# EAGLE design Arm Board V3 (EAGLE 6.5.0)

## Sheet 1 of 6: Power
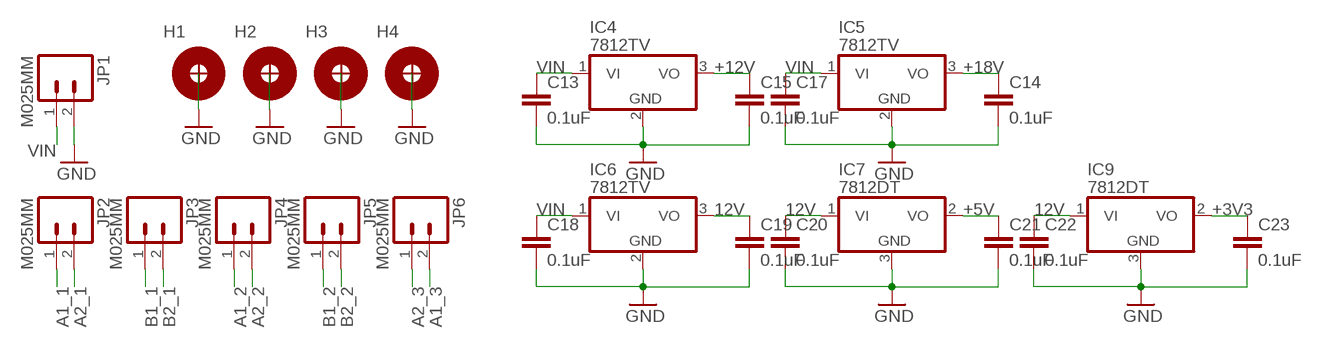
[diagram p0: schematic, sheet 1]

### Parts
C13  0.1uF  0.1UF-25V(+80/-20%)(0603)  [0603-CAP]
C14  0.1uF  0.1UF-25V(+80/-20%)(0603)  [0603-CAP]
C15  0.1uF  0.1UF-25V(+80/-20%)(0603)  [0603-CAP]
C17  0.1uF  0.1UF-25V(+80/-20%)(0603)  [0603-CAP]
C18  0.1uF  0.1UF-25V(+80/-20%)(0603)  [0603-CAP]
C19  0.1uF  0.1UF-25V(+80/-20%)(0603)  [0603-CAP]
C20  0.1uF  0.1UF-25V(+80/-20%)(0603)  [0603-CAP]
C21  0.1uF  0.1UF-25V(+80/-20%)(0603)  [0603-CAP]
C22  0.1uF  0.1UF-25V(+80/-20%)(0603)  [0603-CAP]
C23  0.1uF  0.1UF-25V(+80/-20%)(0603)  [0603-CAP]
H1  H_MNTHOLE_#4  [H_MNTHOLE_#4]
H2  H_MNTHOLE_#4  [H_MNTHOLE_#4]
H3  H_MNTHOLE_#4  [H_MNTHOLE_#4]
H4  H_MNTHOLE_#4  [H_MNTHOLE_#4]
IC4  7812TV  [TO220V]
IC5  7812TV  [TO220V]
IC6  7812TV  [TO220V]
IC7  7812DT  [TO252]
IC9  7812DT  [TO252]
JP1  M025MM  [SCREWTERMINAL-5MM-2]
JP2  M025MM  [SCREWTERMINAL-5MM-2]
JP3  M025MM  [SCREWTERMINAL-5MM-2]
JP4  M025MM  [SCREWTERMINAL-5MM-2]
JP5  M025MM  [SCREWTERMINAL-5MM-2]
JP6  M025MM  [SCREWTERMINAL-5MM-2]

### Nets
12V: C19.1 C20.1 C22.1 IC6.3(VO) IC7.1(VI) IC9.1(VI)
+3V3: C23.1 IC9.2(VO) ; also sheet 3,4,5
+5V: C21.1 IC7.2(VO) ; also sheet 4
+12V: C15.1 IC4.3(VO) ; also sheet 2
+18V: C14.1 IC5.3(VO) ; also sheet 3
A1_1: JP2.1 ; also sheet 2
A1_2: JP4.1 ; also sheet 2
A1_3: JP6.2 ; also sheet 2
A2_1: JP2.2 ; also sheet 2
A2_2: JP4.2 ; also sheet 2
A2_3: JP6.1 ; also sheet 2
B1_1: JP3.1 ; also sheet 2
B1_2: JP5.1 ; also sheet 2
B2_1: JP3.2 ; also sheet 2
B2_2: JP5.2 ; also sheet 2
GND: C13.2 C14.2 C15.2 C17.2 C18.2 C19.2 C20.2 C21.2 C22.2 C23.2 H1.1 H2.1 H3.1 H4.1 IC4.2(GND) IC5.2(GND) IC6.2(GND) IC7.3(GND) IC9.3(GND) JP1.2 ; also sheet 2,3,4,5
VIN: C13.1 C17.1 C18.1 IC4.1(VI) IC5.1(VI) IC6.1(VI) JP1.1 ; also sheet 2

## Sheet 2 of 6: Motor Drivers
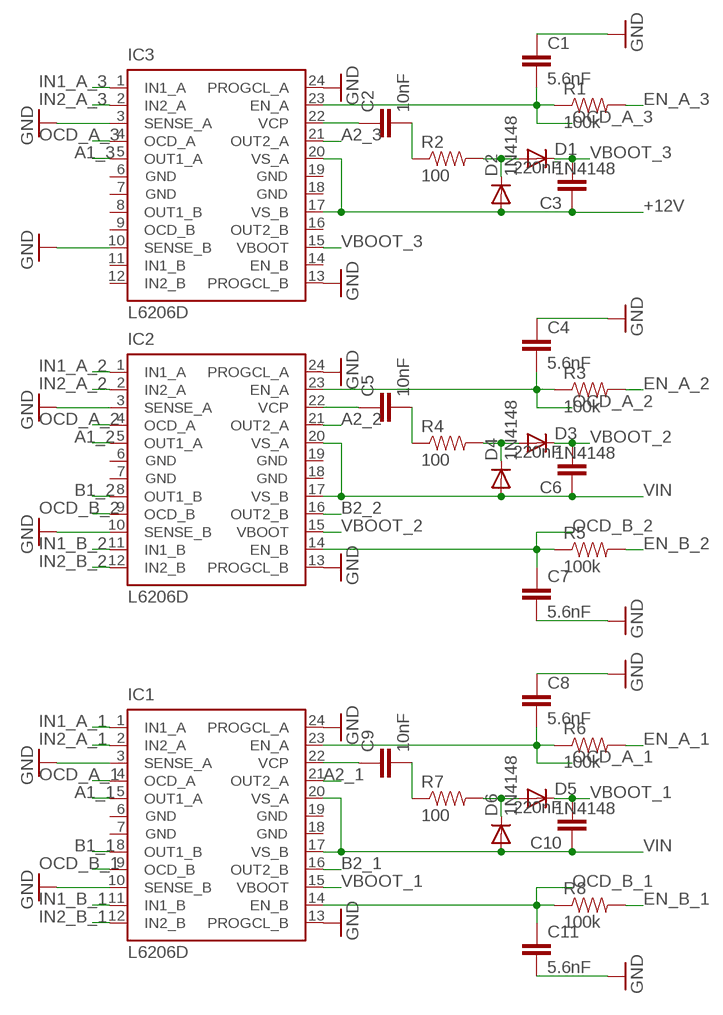
[diagram p1: schematic, sheet 2]

### Parts
C1  5.6nF  0.1UF-25V(+80/-20%)(0603)  [0603-CAP]
C2  10nF  0.1UF-25V-5%(0603)  [0603-CAP]
C3  220nF  0.1UF-25V-5%(0603)  [0603-CAP]
C4  5.6nF  0.1UF-25V(+80/-20%)(0603)  [0603-CAP]
C5  10nF  0.1UF-25V-5%(0603)  [0603-CAP]
C6  220nF  0.1UF-25V-5%(0603)  [0603-CAP]
C7  5.6nF  0.1UF-25V(+80/-20%)(0603)  [0603-CAP]
C8  5.6nF  0.1UF-25V(+80/-20%)(0603)  [0603-CAP]
C9  10nF  0.1UF-25V-5%(0603)  [0603-CAP]
C10  220nF  0.1UF-25V-5%(0603)  [0603-CAP]
C11  5.6nF  0.1UF-25V(+80/-20%)(0603)  [0603-CAP]
D1  1N4148  DIODE1N4148  [DIODE-1N4148]
D2  1N4148  DIODE1N4148  [DIODE-1N4148]
D3  1N4148  DIODE1N4148  [DIODE-1N4148]
D4  1N4148  DIODE1N4148  [DIODE-1N4148]
D5  1N4148  DIODE1N4148  [DIODE-1N4148]
D6  1N4148  DIODE1N4148  [DIODE-1N4148]
IC1  L6206D  [SO24]
IC2  L6206D  [SO24]
IC3  L6206D  [SO24]
R1  100k  RESISTOR0805-RES  [0805]
R2  100  RESISTOR0805-RES  [0805]
R3  100k  RESISTOR0805-RES  [0805]
R4  100  RESISTOR0805-RES  [0805]
R5  100k  RESISTOR0805-RES  [0805]
R6  100k  RESISTOR0805-RES  [0805]
R7  100  RESISTOR0805-RES  [0805]
R8  100k  RESISTOR0805-RES  [0805]

### Nets
+12V: C3.1 D2.A IC3.17(VS_B) IC3.20(VS_A) ; also sheet 1
A1_1: IC1.5(OUT1_A) ; also sheet 1
A1_2: IC2.5(OUT1_A) ; also sheet 1
A1_3: IC3.5(OUT1_A) ; also sheet 1
A2_1: IC1.21(OUT2_A) ; also sheet 1
A2_2: IC2.21(OUT2_A) ; also sheet 1
A2_3: IC3.21(OUT2_A) ; also sheet 1
B1_1: IC1.8(OUT1_B) ; also sheet 1
B1_2: IC2.8(OUT1_B) ; also sheet 1
B2_1: IC1.16(OUT2_B) ; also sheet 1
B2_2: IC2.16(OUT2_B) ; also sheet 1
EN_A_1: R6.2 ; also sheet 4
EN_A_2: R3.2 ; also sheet 4
EN_A_3: R1.2 ; also sheet 4
EN_B_1: R8.2 ; also sheet 4
EN_B_2: R5.2 ; also sheet 4
GND: C1.1 C4.1 C7.2 C8.1 C11.2 IC1.3(SENSE_A) IC1.10(SENSE_B) IC1.13(PROGCL_B) IC1.24(PROGCL_A) IC2.3(SENSE_A) IC2.10(SENSE_B) IC2.13(PROGCL_B) IC2.24(PROGCL_A) IC3.3(SENSE_A) IC3.10(SENSE_B) IC3.13(PROGCL_B) IC3.24(PROGCL_A) ; also sheet 1,3,4,5
IN1_A_1: IC1.1(IN1_A) ; also sheet 4
IN1_A_2: IC2.1(IN1_A) ; also sheet 4
IN1_A_3: IC3.1(IN1_A) ; also sheet 4
IN1_B_1: IC1.11(IN1_B) ; also sheet 4
IN1_B_2: IC2.11(IN1_B) ; also sheet 4
IN2_A_1: IC1.2(IN2_A) ; also sheet 4
IN2_A_2: IC2.2(IN2_A) ; also sheet 4
IN2_A_3: IC3.2(IN2_A) ; also sheet 4
IN2_B_1: IC1.12(IN2_B) ; also sheet 4
IN2_B_2: IC2.12(IN2_B) ; also sheet 4
N$8: D3.A D4.C R4.2
N$9: D5.A D6.C R7.2
N$10: C5.2 R4.1
N$13: C9.1 IC1.22(VCP)
N$15: C9.2 R7.1
N$16: C5.1 IC2.22(VCP)
N$17: D1.A D2.C R2.2
N$18: C2.2 R2.1
N$19: C2.1 IC3.22(VCP)
OCD_A_1: C8.2 IC1.4(OCD_A) IC1.23(EN_A) R6.1
OCD_A_2: C4.2 IC2.4(OCD_A) IC2.23(EN_A) R3.1
OCD_A_3: C1.2 IC3.4(OCD_A) IC3.23(EN_A) R1.1
OCD_B_1: C11.1 IC1.9(OCD_B) IC1.14(EN_B) R8.1
OCD_B_2: C7.1 IC2.9(OCD_B) IC2.14(EN_B) R5.1
VBOOT_1: C10.2 D5.C IC1.15(VBOOT)
VBOOT_2: C6.2 D3.C IC2.15(VBOOT)
VBOOT_3: C3.2 D1.C IC3.15(VBOOT)
VIN: C6.1 C10.1 D4.A D6.A IC1.17(VS_B) IC1.20(VS_A) IC2.17(VS_B) IC2.20(VS_A) ; also sheet 1
Unconnected: IC3.8(OUT1_B) IC3.9(OCD_B) IC3.11(IN1_B) IC3.12(IN2_B) IC3.14(EN_B) IC3.16(OUT2_B)

## Sheet 3 of 6: Dynamixel
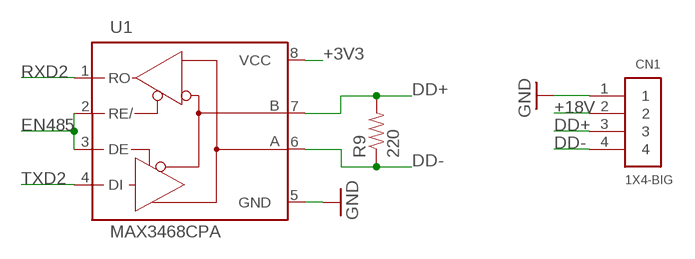
[diagram p2: schematic, sheet 3]

### Parts
CN1  1X4-BIG  [1X04-BIG]
R9  220  RESISTOR0603-RES  [0603-RES]
U1  MAX3468CPA  [DIL08]

### Nets
+3V3: U1.8(VCC) ; also sheet 1,4,5
+18V: CN1.2 ; also sheet 1
DD+ [USB]: CN1.3 R9.2 U1.7(B)
DD-: CN1.4 R9.1 U1.6(A)
EN485: U1.2(RE/) U1.3(DE) ; also sheet 4
GND: CN1.1 U1.5(GND) ; also sheet 1,2,4,5
RXD2: U1.1(RO) ; also sheet 4
TXD2: U1.4(DI) ; also sheet 4

## Sheet 4 of 6: Processor
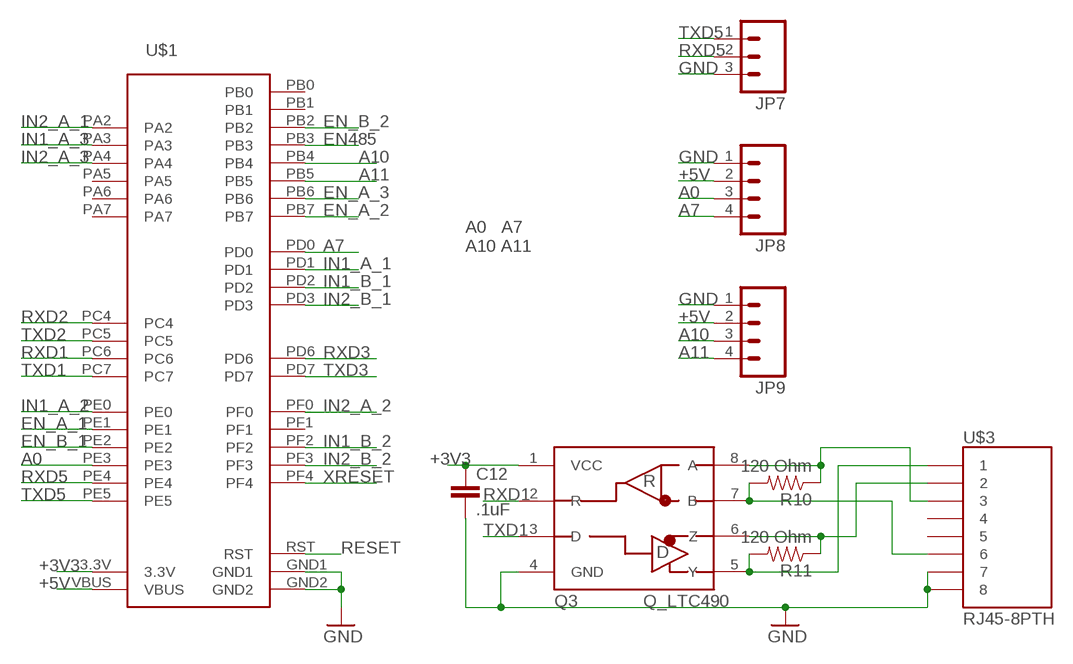
[diagram p3: schematic, sheet 4]

### Parts
C12  .1uF  0.1UF-25V-5%(0603)  [0603-CAP]
JP7  M03PTH  [1X03]
JP8  M04PTH  [1X04]
JP9  M04PTH  [1X04]
Q3  Q_LTC490  [DIP8]
R10  120 Ohm  RESISTOR0603-RES  [0603-RES]
R11  120 Ohm  RESISTOR0603-RES  [0603-RES]
U$1  STELLARIS-LAUNCHPADSTELLARIS-LAUNCHPAD-XL  [LAUNCHPAD-XL]
U$3  RJ45-8PTH  [RJ45-8]

### Nets
+3V3: C12.1 Q3.1(VCC) U$1.3.3V ; also sheet 1,3,5
+5V: JP8.2 JP9.2 U$1.VBUS ; also sheet 1
A0: JP8.3 U$1.PE3
A7: JP8.4 U$1.PD0
A10: JP9.3 U$1.PB4
A11: JP9.4 U$1.PB5
EN485: U$1.PB3 ; also sheet 3
EN_A_1: U$1.PE1 ; also sheet 2
EN_A_2: U$1.PB7 ; also sheet 2
EN_A_3: U$1.PB6 ; also sheet 2
EN_B_1: U$1.PE2 ; also sheet 2
EN_B_2: U$1.PB2 ; also sheet 2
GND: C12.2 JP7.3 JP8.1 JP9.1 Q3.4(GND) U$1.GND1 U$1.GND2 U$3.7 U$3.8 ; also sheet 1,2,3,5
IN1_A_1: U$1.PD1 ; also sheet 2
IN1_A_2: U$1.PE0 ; also sheet 2
IN1_A_3: U$1.PA3 ; also sheet 2
IN1_B_1: U$1.PD2 ; also sheet 2
IN1_B_2: U$1.PF2 ; also sheet 2
IN2_A_1: U$1.PA2 ; also sheet 2
IN2_A_2: U$1.PF0 ; also sheet 2
IN2_A_3: U$1.PA4 ; also sheet 2
IN2_B_1: U$1.PD3 ; also sheet 2
IN2_B_2: U$1.PF3 ; also sheet 2
N$1: Q3.6(Z) R11.1 U$3.2
N$2: Q3.7(B) R10.2 U$3.6
N$3: Q3.8(A) R10.1 U$3.3
N$5: Q3.5(Y) R11.2 U$3.1
RESET: U$1.RST
RXD1: Q3.2(R) U$1.PC6
RXD2: U$1.PC4 ; also sheet 3
RXD3: U$1.PD6 ; also sheet 5
RXD5: JP7.2 U$1.PE4
TXD1: Q3.3(D) U$1.PC7
TXD2: U$1.PC5 ; also sheet 3
TXD3: U$1.PD7 ; also sheet 5
TXD5: JP7.1 U$1.PE5
XRESET: U$1.PF4 ; also sheet 5
Unconnected: U$1.PA5 U$1.PA6 U$1.PA7 U$1.PB0 U$1.PB1 U$1.PF1 U$3.4 U$3.5

### Notes on the sheet
- A0   A7
  A10 A11

## Sheet 5 of 6: Xbee
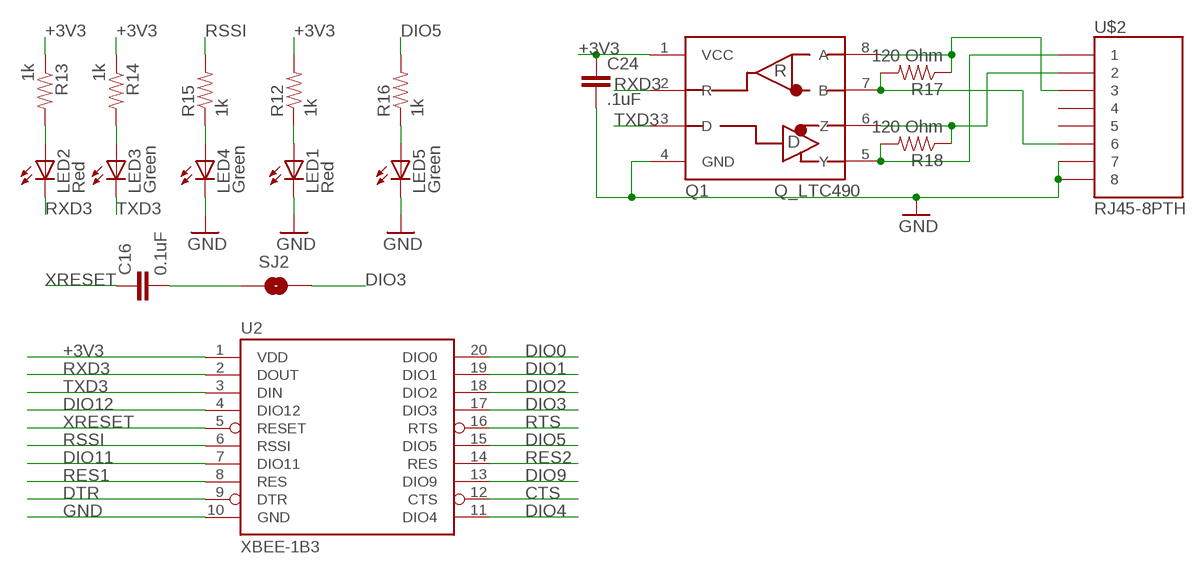
[diagram p4: schematic, sheet 5]

### Parts
C16  0.1uF  0.1UF-25V(+80/-20%)(0603)  [0603-CAP]
C24  .1uF  0.1UF-25V-5%(0603)  [0603-CAP]
LED1  Red  LED-RED0603  [LED-0603]
LED2  Red  LED-RED0603  [LED-0603]
LED3  Green  LED-GREEN0603  [LED-0603]
LED4  Green  LED-GREEN0603  [LED-0603]
LED5  Green  LED-GREEN0603  [LED-0603]
Q1  Q_LTC490  [DIP8]
R12  1k  1KOHM1/10W1%(0603)  [0603-RES]
R13  1k  1KOHM1/10W1%(0603)  [0603-RES]
R14  1k  1KOHM1/10W1%(0603)  [0603-RES]
R15  1k  1KOHM1/10W1%(0603)  [0603-RES]
R16  1k  1KOHM1/10W1%(0603)  [0603-RES]
R17  120 Ohm  RESISTOR0603-RES  [0603-RES]
R18  120 Ohm  RESISTOR0603-RES  [0603-RES]
SJ2  SOLDERJUMPERTRACE  [SJ_2S-TRACE]
U2  XBEE-1B3  [XBEE-SMD]
U$2  RJ45-8PTH  [RJ45-8]

### Nets
+3V3: C24.1 Q1.1(VCC) R12.2 R13.1 R14.1 U2.1(VDD) ; also sheet 1,3,4
CTS: U2.12(CTS)
DIO0: U2.20(DIO0)
DIO1: U2.19(DIO1)
DIO2: U2.18(DIO2)
DIO3: SJ2.2 U2.17(DIO3)
DIO4: U2.11(DIO4)
DIO5: R16.2 U2.15(DIO5)
DIO9: U2.13(DIO9)
DIO11: U2.7(DIO11)
DIO12: U2.4(DIO12)
DTR: U2.9(DTR)
GND: C24.2 LED1.C LED4.C LED5.C Q1.4(GND) U2.10(GND) U$2.7 U$2.8 ; also sheet 1,2,3,4
N$4: LED2.A R13.2
N$6: LED3.A R14.2
N$7: LED4.A R15.1
N$11: C16.2 SJ2.1
N$12: Q1.5(Y) R18.2 U$2.1
N$14: Q1.6(Z) R18.1 U$2.2
N$20: Q1.7(B) R17.2 U$2.6
N$21: Q1.8(A) R17.1 U$2.3
N$38: LED1.A R12.1
N$139: LED5.A R16.1
RES1: U2.8(RES)
RES2: U2.14(RES)
RSSI: R15.2 U2.6(RSSI)
RTS: U2.16(RTS)
RXD3: LED2.C Q1.2(R) U2.2(DOUT) ; also sheet 4
TXD3: LED3.C Q1.3(D) U2.3(DIN) ; also sheet 4
XRESET: C16.1 U2.5(RESET) ; also sheet 4
Unconnected: U$2.4 U$2.5

## Sheet 6 of 6: Encoders

## Power pins joined to a net without a drawn wire
GND: IC1.6(GND) IC1.7(GND) IC1.18(GND) IC1.19(GND) IC2.6(GND) IC2.7(GND) IC2.18(GND) IC2.19(GND) IC3.6(GND) IC3.7(GND) IC3.18(GND) IC3.19(GND)

## Library data of the parts
C1 C4 C7 C8 C11 = SparkFun-Capacitors:0.1UF-25V(+80/-20%)(0603): CAP-00810 Ceramic Standard decoupling cap; PROD_ID: CAP-00810; VALUE: 0.1uF
C2 C3 C5 C6 C9 C10 C12 C24 = SparkFun-Capacitors:0.1UF-25V-5%(0603): CAP-08604; PROD_ID: CAP-08604; VALUE: 0.1uF
C13-C23 = SparkFun-Capacitors:0.1UF-25V(+80/-20%)(0603): CAP-00810 Ceramic Standard decoupling cap; PROD_ID: CAP-00810
CN1 = adafruit:1X4: 4-pin connector
D1-D6 = SparkFun-DiscreteSemi:DIODE: Diode These are standard reverse protection diodes and small signal diodes. SMA package can handle up to about 1A. SOD-323 can handle about 200mA. What the SOD-323 package when ordering, there are some mfgs out there that are 5-pin packages.
H1-H4 = Lib_TH:H_MNTHOLE
IC1-IC3 = L6206D:L6206: DUAL DMOS FULL BRIDGE MOTOR DRIVER
IC4-IC7 IC9 = linear:78*: Positive VOLTAGE REGULATOR Source: http://cache.national.com/ds/LM/LM78L05.pdf http://www.fairchildsemi.com/ds/LM/LM7805.pdf
JP1-JP6 = SparkFun-Connectors:M02: Standard 2-pin 0.1" header. Use with - straight break away headers ( PRT-00116) - right angle break away headers (PRT-00553) - swiss pins (PRT-00743) - machine pins (PRT-00117) - female headers (PRT-00115) Molex polarized connector foot print use with: PRT-08233 with associated crimp pins and housings. 2.54_SCREWTERM for use with PRT-10571. 3.5mm Screw Terminal footprints for PRT-08084 5mm Screw Terminal footprints for use with PRT-08433
JP7 = SparkFun-Connectors:M03: Header 3 Standard 3-pin 0.1" header. Use with straight break away headers (SKU : PRT-00116), right angle break away headers (PRT-00553), swiss pins (PRT-00743), machine pins (PRT-00117), and female headers (PRT-00115). Molex polarized connector foot print use with SKU : PRT-08232 with associated crimp pins and housings.
JP8 JP9 = SparkFun-Connectors:M04: Header 4 Standard 4-pin 0.1" header. Use with straight break away headers (SKU : PRT-00116), right angle break away headers (PRT-00553), swiss pins (PRT-00743), machine pins (PRT-00117), and female headers (PRT-00115). Molex polarized connector foot print use with SKU : PRT-08231 with associated crimp pins and housings. 1MM SMD Version SKU: PRT-10208
LED1 LED2 = SparkFun-LED:LED-RED: Assorted Red LEDs LilyPad 1206- DIO-09912 1206- DIO-00809 0603- DIO-00819; PROD_ID: DIO-00819; VALUE: RED
LED3-LED5 = SparkFun-LED:LED-GREEN: Various green LEDs Green LEDs used in SFE Production 0603- DIO-00821 LARGE- DIO-00862 LILYPAD- DIO-09910; PROD_ID: DIO-00821; VALUE: GREEN
Q1 Q3 = PCB0M1:Q_LTC490: IC, RS422-RS485 DRVR
R1-R11 R17 R18 = SparkFun-Passives:RESISTOR: Resistor Basic schematic elements and footprints for 0603, 1206, and PTH resistors.
R12-R16 = SparkFun-Resistors:1KOHM1/10W1%(0603): RES-07856; PROD_ID: RES-07856; VALUE: 1K
SJ2 = SparkFun:SOLDERJUMPER: Solder Jumper Standard SMD solder jumper. Used to automate production. Two varients : Normally Open and Normally Closed are the same, but have different paste layers. NC will have a large amount of paste and should jumper during reflow.
U1 = maxim:MAX34*: +5V, Fail-Safe, 40Mbps, Profibus RS-485/RS-422 Transceivers Source: MAX3465-MAX3469.pdf; OC_FARNELL: unknown; OC_NEWARK: unknown
U2 = SparkFun:XBEE-1
U$1 = StellarisLaunchPad_Fred:STELLARIS-LAUNCHPAD
U$2 U$3 = SparkFun-Connectors:RJ45-8: RJ45 Jack Simple RJ45, 8-pin connection - connector for common Cat5, Cat5e, and Cat6 Ethernet cables. Footprint not yet proven in production. Connector sku is PRT-00643; Breakout PCB sku is BOB-00716.

## Net classes
1 USB: drill 0.406 mm, clearance 0.203 mm to class 0, clearance 0.406 mm
3 usbvcc: width 0.61 mm, drill 0.508 mm, clearance 0.203 mm to class 0, clearance 0.254 mm

## Board
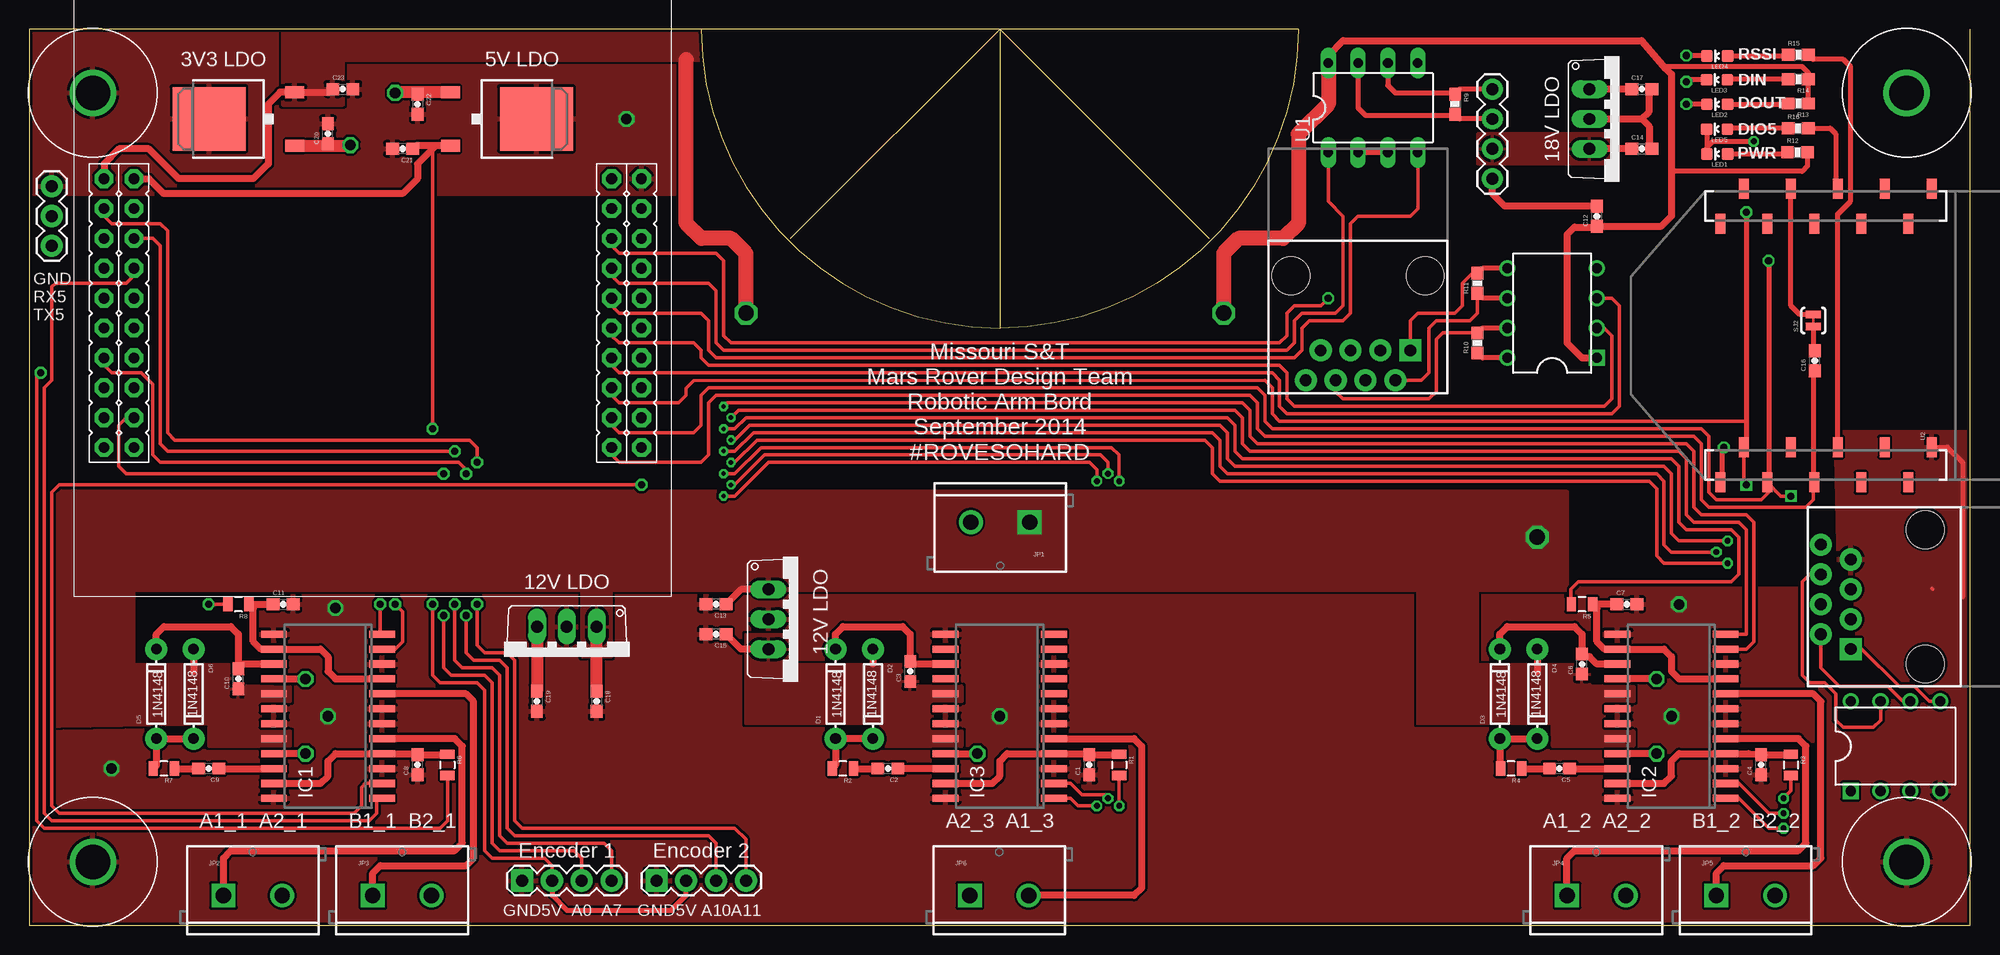
[diagram p5: board, top side]
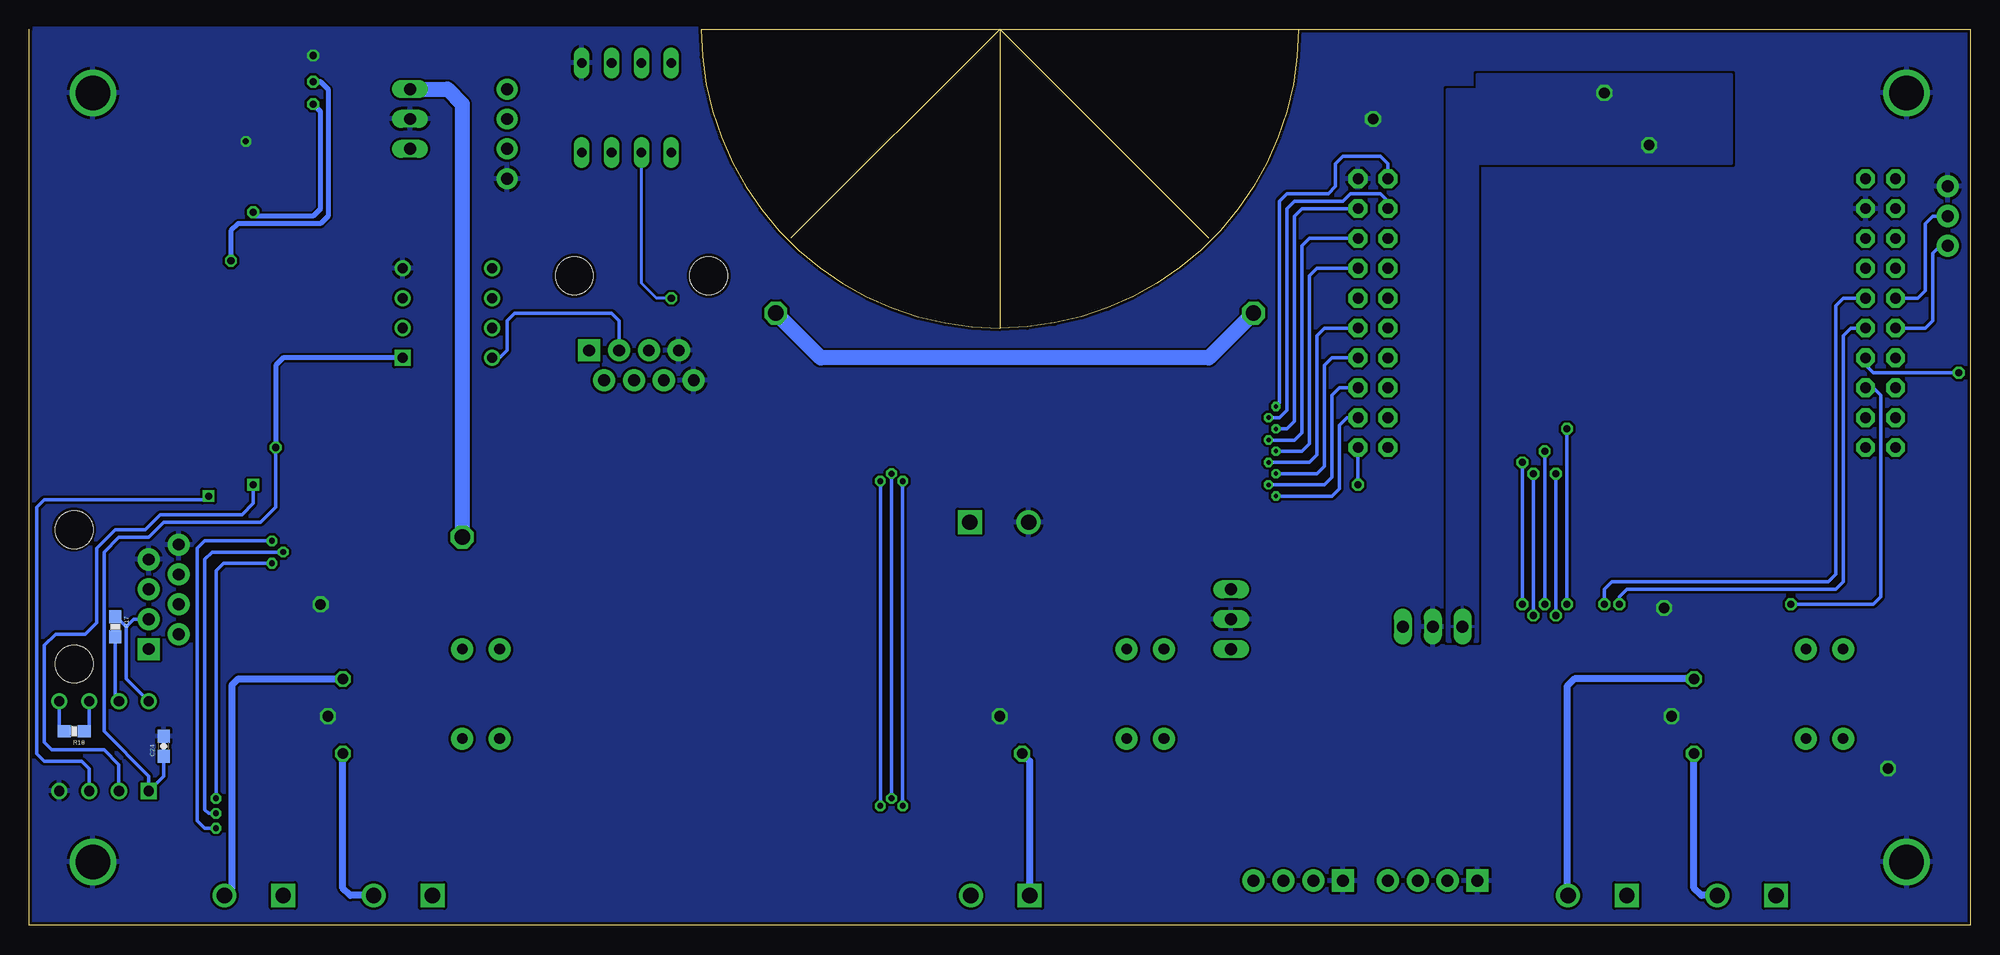
[diagram p6: board, bottom side, seen from below]

Size 165.1 x 76.2 mm. Coordinates in mm from the lower left corner, seen from the top.
Outline: 165.1,76.2 165.1,0 0,0 0,76.2 57.15,76.2
Outline: 82.55,76.2 107.95,76.2 arc-90 82.55,50.8
Outline: 82.55,76.2 57.15,76.2
Outline: 82.55,76.2 82.55,50.8
Outline: 57.15,76.2 arc90 82.55,50.8
Outline: 64.77,58.42 82.55,76.2
Outline: 82.55,76.2 100.33,58.42
Copper layers (1*16): Top 0.035mm / dielectric 1.5mm / Bottom 0.035mm
Design rules "LaenPCBOrder": minimum track width 8mil, minimum drill 10mil, track to track 8mil, track to pad 8mil, pad to pad 8mil, via to via 8mil, smd to smd 8mil, copper to edge 10mil, drill to drill 8mil, minimum pad ring 10mil, minimum via ring 8mil, stop-mask expansion 4mil, vias tented up to drill 0mil, thermal gap 10mil

### Footprints (pad centres in the part's own frame; a part is rotated, then mirrored left to right if it is on the bottom)
0603-CAP = smd 1.1 x 1: 1 -0.85,0; 2 0.85,0
1X04-BIG = drill 1.016 pad 1.778: 1 0,0; 2 2.54,0; 3 5.08,0; 4 7.62,0
DIODE-1N4148 = drill 0.9 pad 1.88: A -3.81,0; C 3.81,0
H_MNTHOLE_#4 = drill 2.946: 1 0,0
SO24 = smd 0.6 x 2.2: 1 -6.985,-4.6; 2 -5.715,-4.6; 3 -4.445,-4.6; 4 -3.175,-4.6; 5 -1.905,-4.6; 6 -0.635,-4.6; 7 0.635,-4.6; 8 1.905,-4.6; 9 3.175,-4.6; 10 4.445,-4.6; 11 5.715,-4.6; 12 6.985,-4.6; 13 6.985,4.6; 14 5.715,4.6; 15 4.445,4.6; 16 3.175,4.6; 17 1.905,4.6; 18 0.635,4.6; 19 -0.635,4.6; 20 -1.905,4.6; 21 -3.175,4.6; 22 -4.445,4.6; 23 -5.715,4.6; 24 -6.985,4.6
TO220V = drill 1.016 long: 1 -2.54,-2.54; 2 0,-2.54; 3 2.54,-2.54
TO252 = smd 1 x 1.6: 1 -2.28,-4.8; 2 2.28,-4.8 | smd 5.4 x 6.2: 3 0,2.5
SCREWTERMINAL-5MM-2 = drill 1.3 pad 2.032 square: 1 0,0 | drill 1.3 pad 2.032: 2 5,0
1X03 = drill 1.016 pad 1.88: 1 0,0; 2 2.54,0; 3 5.08,0
1X04 = drill 1.016 pad 1.88 square: 1 0,0 | drill 1.016 pad 1.88: 2 2.54,0; 3 5.08,0; 4 7.62,0
LED-0603 = smd 1 x 1: A 0,-0.877; C 0,0.877
DIP8 = drill 0.864 square: 1 -3.81,-3.81 | drill 0.864: 2 -1.27,-3.81; 3 1.27,-3.81; 4 3.81,-3.81; 5 3.81,3.81; 6 1.27,3.81; 7 -1.27,3.81; 8 -3.81,3.81
0805 = smd 0.8 x 1.2: 1 -0.9,0; 2 0.9,0
0603-RES = smd 1.1 x 1: 1 -0.85,0; 2 0.85,0
SJ_2S-TRACE = smd 0.635 x 1.27: 1 -0.508,0; 2 0.508,0
DIL08 = drill 0.813 long: 1 -3.81,-3.81; 2 -1.27,-3.81; 3 1.27,-3.81; 4 3.81,-3.81; 5 3.81,3.81; 6 1.27,3.81; 7 -1.27,3.81; 8 -3.81,3.81
XBEE-SMD = smd 1.7 x 0.85: 1 -12.5,20; 2 -9.5,18; 3 -12.5,16; 4 -9.5,14; 5 -12.5,12; 6 -9.5,10; 7 -12.5,8; 8 -9.5,6; 9 -12.5,4; 10 -9.5,2; 11 12.5,2; 12 9.5,4; 13 12.5,6; 14 9.5,8; 15 12.5,10; 16 9.5,12; 17 12.5,14; 18 9.5,16; 19 12.5,18; 20 9.5,20
LAUNCHPAD-XL = drill 0.914 pad 1.6 octagon: 3.3V 30.48,2.54; GND1 33.02,5.08; GND2 30.48,48.26; PA2 53.34,48.26; PA3 50.8,48.26; PA4 48.26,48.26; PA5 48.26,2.54; PA6 50.8,2.54; PA7 53.34,2.54; PB0 35.56,2.54; PB1 38.1,2.54; PB2 33.02,48.26; PB3 35.56,45.72; PB4 45.72,2.54; PB5 33.02,2.54; PB6 45.72,48.26; PB7 43.18,48.26; PC4 38.1,45.72; PC5 40.64,45.72; PC6 43.18,45.72; PC7 45.72,45.72; PD0 35.56,5.08; PD1 38.1,5.08; PD2 40.64,5.08; PD3 43.18,5.08; PD6 48.26,45.72; PD7 50.8,45.72; PE0 35.56,48.26; PE1 45.72,5.08; PE2 48.26,5.08; PE3 50.8,5.08; PE4 40.64,2.54; PE5 43.18,2.54; PF0 38.1,48.26; PF1 53.34,5.08; PF2 30.48,45.72; PF3 33.02,45.72; PF4 53.34,45.72; RST 40.64,48.26; VBUS 30.48,5.08
RJ45-8 = drill 1 pad 1.88 square: 1 -4.445,6.35 | drill 1 pad 1.88: 2 -3.175,8.89; 3 -1.905,6.35; 4 -0.635,8.89; 5 0.635,6.35; 6 1.905,8.89; 7 3.175,6.35; 8 4.445,8.89 | hole 3.2: -5.715,0; 5.715,0

### Placement (x,y rotation side)
C1  90.17,13.65 90 top
C2  73.03,13.34 180 top
C3  74.93,21.59 90 top
C4  147.32,13.65 90 top
C5  130.18,13.34 180 top
C6  132.08,22.23 90 top
C7  135.89,27.3 0 top
C8  33.02,13.65 90 top
C9  15.24,13.34 180 top
C10  17.78,20.95 90 top
C11  21.59,27.3 0 top
C12  133.35,60.33 90 top
C13  58.42,27.3 180 top
C14  137.16,66.04 0 top
C15  58.42,24.77 180 top
C16  151.89,48.01 90 top
C17  137.16,71.12 0 top
C18  48.26,19.05 270 top
C19  43.18,19.05 270 top
C20  25.4,67.31 90 top
C21  31.75,66.04 180 top
C22  33.02,69.85 270 top
C23  26.67,71.12 0 top
C24  153.67,15.24 90 bottom
CN1  124.46,63.5 90 top
D1  68.58,19.68 90 top
D2  71.75,19.68 270 top
D3  125.09,19.68 90 top
D4  128.27,19.68 270 top
D5  10.79,19.68 90 top
D6  13.97,19.68 270 top
H1  5.4,5.4 0 top
H2  5.4,70.8 0 top
H3  159.7,70.8 0 top
H4  159.7,5.4 0 top
IC1  25.4,17.78 90 top
IC2  139.7,17.78 90 top
IC3  82.55,17.78 90 top
IC4  65.41,26.04 270 top
IC5  135.25,68.58 270 top
IC6  45.72,22.86 180 top
IC7  40.64,68.58 270 top
IC9  17.78,68.58 90 top
JP1  85.09,34.29 180 top
JP2  16.51,2.54 0 top
JP3  29.21,2.54 0 top
JP4  130.81,2.54 0 top
JP5  143.51,2.54 0 top
JP6  80.01,2.54 0 top
JP7  1.91,57.78 90 top
JP8  41.91,3.81 0 top
JP9  53.34,3.81 0 top
LED1  143.59,65.61 90 top
LED2  143.59,69.82 90 top
LED3  143.56,71.91 90 top
LED4  143.59,73.94 90 top
LED5  143.56,67.72 90 top
Q1  158.75,15.24 0 top
Q3  129.54,52.07 90 top
R1  92.71,13.65 270 top
R2  69.22,13.34 180 top
R3  149.86,13.65 270 top
R4  126.05,13.34 180 top
R5  132.08,27.3 180 top
R6  35.56,13.65 270 top
R7  11.43,13.34 180 top
R8  17.78,27.3 180 top
R9  121.28,69.85 270 top
R10  123.19,49.53 90 top
R11  123.19,54.61 90 top
R12  150.42,65.76 0 top
R13  150.5,69.9 180 top
R14  150.5,71.96 180 top
R15  150.5,74.04 0 top
R16  150.47,67.79 0 top
R17  157.8,25.4 270 bottom
R18  161.29,16.51 180 bottom
SJ2  151.76,51.44 90 top
U1  114.3,69.53 0 top
U2  163.83,50.16 90 top
U$1  3.81,93.98 270 top
U$2  161.29,27.94 90 top
U$3  113.03,55.24 180 top

### Tracks (layer width: path | path; a pad name or v marks a point on that pad's centre or on a via)
12V  (via drill 0.9)
  Top 0.61: C20.1 25.4,66.3 | C22.1 33.02,70.86
  Top 1.016: IC6.3 C19.1 | IC9.1 25.4,66.3 27.25,66.3 v27.3,66.36 | IC7.1 33.02,70.86 31.17,70.86 v31.11,70.8
  pour Bottom: 41.91,24.13 44.45,24.13 44.45,71.12 41.91,71.12
  pour Bottom: 41.91,72.39 20.32,72.39 20.32,64.77 41.91,64.77
+3V3  (via drill 0.6, 1.3)
  Top 0.406: R13.1 R14.1 151.34,72.49 150.81,73.03 139.38,73.03 139.22,72.87 | U2.1 144.03,37.47 144.03,40.52 v144.15,40.64 | R12.2 151.27,64.59 150.81,64.14 139.7,64.14
  Top 0.61: U$1.3.3V 6.35,64.77 7.62,66.04 10.16,66.04 12.7,63.5 19.05,63.5 20.32,64.77 20.32,69.85 21.33,70.86 IC9.2 25.56,70.86 C23.1 | Q3.1 132.08,48.26 130.81,49.53 130.81,58.74 131.44,59.37 133.25,59.37 C12.1 138.85,59.48 139.7,60.33 139.7,64.14 139.7,72.39 139.22,72.87 137.16,75.25 111.76,75.25 110.49,73.98 U1.8
  Top 1.27: U1.8 110.49,69.85 107.95,67.31 107.95,59.69 106.68,58.42 102.87,58.42 101.6,57.15 v101.6,52.07 | v60.96,52.07 60.96,57.15 59.69,58.42 57.15,58.42 55.88,59.69 55.88,73.66
  Bottom 0.305: v144.15,40.64 144.15,35.56 145.41,34.29 153.67,34.29 154.94,33.02 157.48,33.02 158.75,31.75 158.75,16.51 154.94,12.7 Q1.1 153.67,12.7 C24.1
  Bottom 0.406: Q3.1 143.51,48.26 144.15,47.62 v144.15,40.64
  Bottom 1.27: v60.96,52.07 64.77,48.26 97.79,48.26 v101.6,52.07
  pour Top: 21.59,76.2 21.59,69.85 26.67,69.85 26.67,73.66 57.15,73.66 57.15,76.2
+5V  (via drill 0.6)
  Top 0.305: JP8.2 44.45,5.08 43.81,5.71 39.37,5.71 38.73,6.35 38.73,20 38.1,20.64 34.92,20.64 34.29,21.27 v34.29,27.3 | 36.2,65.94 IC7.2 | v34.29,42.23 34.29,66.04
  Top 0.406: JP8.2 44.45,2.54 45.72,1.27 54.61,1.27 55.88,2.54 JP9.2
  Top 0.61: U$1.VBUS 10.16,63.5 11.43,62.23 31.75,62.23 33.02,63.5 33.02,64.77 34.29,66.04 34.55,66.3 | IC7.2 34.55,66.3 | 34.55,66.3 32.86,66.3 C21.1
  Bottom 0.305: v34.29,27.3 v34.29,42.23
+12V
  Top 0.61: D2.A 71.75,22.23 | IC4.3 60.54,23.5 C15.1
  pour Top: 75.56,22.23 75.56,17.14 60.96,17.14 60.96,24.77 64.77,24.77 64.77,22.23
  pour Top (no thermals): 72.39,17.14 72.39,15.24 79.38,15.24 79.38,16.51 76.83,16.51 76.83,19.05 79.38,19.05 79.38,20.32 75.56,20.32 75.56,17.14
+18V
  Top 0.61: C14.1 IC5.3
  pour Top: 123.19,67.31 123.19,64.77 134.62,64.77 134.62,67.31
A0  (via drill 0.6)
  Top 0.305: JP8.3 46.99,5.71 46.35,6.35 40.01,6.35 39.37,6.99 39.37,20.64 38.73,21.27 35.88,21.27 35.24,21.91 v35.24,26.35 | v35.24,38.42 8.26,38.42 7.62,39.05 7.62,42.55 8.26,43.18 U$1.PE3
  Bottom 0.305: v35.24,26.35 v35.24,38.42
A1_1
  Top 0.61: JP2.1 16.51,5.71 17.14,6.35 36.2,6.35 36.83,6.99 36.83,15.24 36.2,15.88 IC1.5
A1_2
  Top 0.61: JP4.1 130.81,5.71 131.44,6.35 150.5,6.35 151.13,6.99 151.13,15.24 150.5,15.88 IC2.5
A1_3
  Top 0.61: IC3.5 93.98,15.88 94.61,15.24 94.61,3.17 93.98,2.54 JP6.2
A2_1  (via drill 0.9)
  Top 0.61: v23.5,14.61 IC1.21
  Bottom 0.61: JP2.2 22.86,2.54 23.5,3.17 v23.5,14.61
A2_2  (via drill 0.9)
  Top 0.61: v138.43,14.61 IC2.21
  Bottom 0.61: JP4.2 137.79,2.54 138.43,3.17 v138.43,14.61
A2_3  (via drill 0.9)
  Top 0.61: IC3.21 v80.64,14.61
  Bottom 0.61: v80.64,14.61 80.01,13.97 JP6.1
A7  (via drill 0.6)
  Top 0.305: JP8.4 49.53,6.35 48.9,6.99 40.64,6.99 40.01,7.62 40.01,21.27 39.37,21.91 36.83,21.91 36.2,22.54 v36.2,27.3 | v36.2,40.32 11.75,40.32 11.11,40.96 11.11,57.78 10.48,58.42 U$1.PD0
  Bottom 0.305: v36.2,27.3 v36.2,40.32
A10  (via drill 0.6)
  Top 0.305: JP9.3 58.42,6.99 57.78,7.62 41.27,7.62 40.64,8.26 40.64,21.91 40.01,22.54 37.78,22.54 37.15,23.18 v37.15,26.35 | v37.15,38.42 37.15,38.73 36.51,39.37 11.11,39.37 10.48,40.01 10.48,46.04 9.53,46.99 6.99,46.99 6.35,47.62 U$1.PB4
  Bottom 0.305: v37.15,26.35 v37.15,38.42
A11  (via drill 0.6)
  Top 0.305: v38.1,27.3 38.1,23.81 38.73,23.18 40.64,23.18 41.27,22.54 41.27,8.89 41.91,8.26 60.01,8.26 60.96,7.3 JP9.4 | v38.1,39.37 38.1,40.64 37.47,41.27 12.38,41.27 11.75,41.91 11.75,59.05 11.11,59.69 6.99,59.69 6.35,60.33 U$1.PB5
  Bottom 0.305: v38.1,27.3 v38.1,39.37
B1_1
  Top 0.61: JP3.1 29.21,4.45 29.84,5.08 37.15,5.08 37.78,5.71 37.78,19.05 37.15,19.68 IC1.8
B1_2
  Top 0.61: JP5.1 143.51,4.45 144.15,5.08 151.76,5.08 152.4,5.71 152.4,19.05 151.76,19.68 IC2.8
B2_1  (via drill 0.9)
  Top 0.61: IC1.16 v23.5,20.95
  Bottom 0.61: v23.5,20.95 33.66,20.95 34.29,20.32 34.29,2.62 JP3.2
B2_2  (via drill 0.9)
  Top 0.61: v138.43,20.95 IC2.16
  Bottom 0.61: v138.43,20.95 147.32,20.95 147.88,20.4 147.88,3.17 JP5.2
DD+
  Top 0.406: U1.7 113.03,69.53 113.67,68.9 120.92,68.9 R9.2 121.66,68.58 CN1.3
DD-
  Top 0.406: U1.6 115.57,71.44 116.2,70.8 121.02,70.8 R9.1 121.66,71.12 CN1.4
DIO3
  Top 0.406: SJ2.2 150.62,51.94 149.86,52.7 149.86,62.63 U2.17
DIO5
  Top 0.406: 151.47,67.94 R16.2 153.19,67.79 153.67,67.31 153.67,62.83 U2.15
EN485  (via drill 0.6)
  Top 0.305: U$1.PB3 49.53,57.78 50.16,57.15 58.42,57.15 59.05,56.52 59.05,50.16 59.69,49.53 106.36,49.53 107,50.16 107,52.07 107.63,52.7 109.86,52.7 v110.49,53.34
  Top 0.406: U1.3 U1.2
  Bottom 0.254: v110.49,53.34 111.76,53.34 113.03,54.61 U1.2
EN_A_1  (via drill 0.6)
  Top 0.305: R6.2 35.56,8.89 34.92,8.26 1.27,8.26 0.64,8.89 0.64,46.67 v0.95,46.99
  Bottom 0.305: v0.95,46.99 8.26,46.99 8.89,47.62 U$1.PE1
EN_A_2  (via drill 0.38, 0.5)
  Top 0.305: v144.46,30.8 139.06,30.8 138.43,31.43 138.43,37.15 137.79,37.78 101.28,37.78 100.65,38.42 100.65,40.64 100.01,41.27 61.91,41.27 60.01,39.37 v59.69,39.37 | v149.22,10.79 149.86,11.43 R3.2
  Bottom 0.305: v144.46,30.8 148.59,30.8 149.22,30.16 v149.22,10.79 | v59.69,39.37 56.2,39.37 55.56,40.01 55.56,50.16 54.93,50.8 U$1.PB7
EN_A_3  (via drill 0.38, 0.5)
  Top 0.305: R1.2 v92.71,10.16 | v92.71,37.78 92.71,40.01 92.08,40.64 62.23,40.64 60.01,38.42 v59.05,38.42
  Bottom 0.305: v92.71,10.16 v92.71,37.78 | v59.05,38.42 55.56,38.42 54.93,39.05 54.93,47.62 54.29,48.26 U$1.PB6
EN_B_1  (via drill 0.6)
  Top 0.305: R8.2 v15.24,27.3
  Bottom 0.305: v15.24,27.3 8.26,27.3 7.62,27.94 7.62,45.09 8.26,45.72 U$1.PE2
EN_B_2  (via drill 0.38)
  Top 0.305: 131.13,27.36 131.13,28.57 131.76,29.21 144.78,29.21 145.41,29.84 145.41,33.02 144.78,33.66 140.97,33.66 140.34,34.29 140.34,39.05 139.7,39.69 103.19,39.69 102.55,40.32 102.55,42.55 101.92,43.18 60.96,43.18 60.01,42.23 v59.05,42.23
  Top 0.406: 131.13,27.36 R5.2
  Bottom 0.305: v59.05,42.23 58.1,42.23 57.47,42.86 57.47,60.33 56.83,60.96 U$1.PB2
GND  (via drill 0.5, 0.6, 0.9)
  Top 0.305: 161.83,28.67 161.93,28.57
  Top 0.406: LED4.C 141.01,73.94 v140.97,73.98 | LED5.C 142.68,65.63 LED1.C 142.71,66.19 143.19,66.67 v146.69,66.67 | U2.10 163.17,40.66 164.47,39.37 164.47,27.94
  Top 0.61: IC5.2 137.16,68.58 | 137.16,68.58 137.79,69.22 137.79,70.91 C17.2 | 137.16,68.58 137.79,67.94 137.79,66.25 C14.2 | C12.2 125.52,61.17 124.46,62.23 CN1.1
  Bottom 0.406: v140.97,73.98 140.97,74.3
  other vias: 25.4,17.78 82.55,17.78 139.7,17.78 6.99,13.34 50.8,68.58 140.34,27.3 26.04,26.99
  pour Bottom (rank 2): 0,0 0,76.2 165.1,76.2 165.1,0
  pour Top (rank 2): 0,28.57 0,0 165.1,0 165.1,41.91 153.67,41.91 153.99,28.57
  pour Top (rank 2): 0,62.23 0,76.2 62.23,76.2 62.23,62.23
IN1_A_1
  Top 0.305: U$1.PD1 8.89,55.24 8.26,54.61 2.22,54.61 1.91,54.29 1.91,46.35 1.27,45.72 1.27,9.53 1.91,8.89 28.89,8.89 29.53,9.53 29.53,10.79 IC1.1
IN1_A_2  (via drill 0.38, 0.5)
  Top 0.305: IC2.1 145.41,10.79 147.96,8.26 v149.22,8.26 | v144.46,32.7 140.34,32.7 139.7,33.34 139.7,38.42 139.06,39.05 102.55,39.05 101.92,39.69 101.92,41.91 101.28,42.55 61.28,42.55 60.01,41.27 v59.69,41.27
  Bottom 0.305: v149.22,8.26 150.18,8.26 150.81,8.89 150.81,32.07 150.18,32.7 v144.46,32.7 | v59.69,41.27 57.47,41.27 56.83,41.91 56.83,57.78 56.2,58.42 U$1.PE0
IN1_A_3  (via drill 0.38, 0.5)
  Top 0.305: IC3.1 88.58,10.79 89.22,10.16 v90.81,10.16 | v90.81,37.78 90.81,38.73 90.17,39.37 62.87,39.37 60.01,36.51 v59.05,36.51
  Bottom 0.305: v90.81,10.16 v90.81,37.78 | v59.05,36.51 54.29,36.51 53.66,37.15 53.66,42.55 53.02,43.18 U$1.PA3
IN1_B_1  (via drill 0.6)
  Top 0.305: IC1.11 31.11,23.5 31.75,24.13 31.75,26.67 v31.11,27.3
  Bottom 0.305: v31.11,27.3 31.11,28.57 30.48,29.21 12.06,29.21 11.43,29.84 11.43,52.7 10.79,53.34 U$1.PD2
IN1_B_2  (via drill 0.38)
  Top 0.305: IC2.11 146.05,23.5 146.69,24.13 146.69,34.29 146.05,34.92 142.24,34.92 141.6,35.56 141.6,40.32 140.97,40.96 104.46,40.96 103.82,41.59 103.82,43.81 103.19,44.45 59.37,44.45 v59.05,44.13
  Bottom 0.305: U$1.PF2 49.53,64.77 50.16,65.41 53.34,65.41 53.98,64.77 53.98,62.87 54.61,62.23 58.1,62.23 58.74,61.59 58.74,44.45 v59.05,44.13
IN2_A_1  (via drill 0.6)
  Top 0.305: IC1.2 28.57,12.06 28.26,11.75 28.26,10.16 27.62,9.53 2.54,9.53 1.91,10.16 1.91,36.83 2.54,37.47 v52.07,37.47
  Bottom 0.305: v52.07,37.47 U$1.PA2
IN2_A_2  (via drill 0.38, 0.5)
  Top 0.305: IC2.2 145.41,12.06 147.96,9.53 v149.22,9.53 | v143.51,31.75 139.7,31.75 139.06,32.38 139.06,37.78 138.43,38.42 101.92,38.42 101.28,39.05 101.28,41.27 100.65,41.91 61.59,41.91 60.01,40.32 v59.05,40.32
  Bottom 0.305: v149.22,9.53 149.86,9.53 150.18,9.84 150.18,31.11 149.54,31.75 v143.51,31.75 | v59.05,40.32 56.83,40.32 56.2,40.96 56.2,55.24 55.56,55.88 U$1.PF0
IN2_A_3  (via drill 0.38, 0.5)
  Top 0.305: v91.76,38.42 91.76,39.37 91.12,40.01 62.55,40.01 60.01,37.47 v59.69,37.47 | IC3.2 88.58,12.06 89.53,11.11 91.44,11.11 v91.76,10.79
  Bottom 0.305: v91.76,10.79 v91.76,38.42 | v59.69,37.47 54.93,37.47 54.29,38.1 54.29,45.09 53.66,45.72 U$1.PA4
IN2_B_1  (via drill 0.6)
  Top 0.305: 29.84,24.92 v29.84,27.3
  Top 0.406: 29.84,24.92 IC1.12
  Bottom 0.305: v29.84,27.3 29.84,27.94 29.21,28.57 11.43,28.57 10.79,29.21 10.79,50.16 10.16,50.8 U$1.PD3
IN2_B_2  (via drill 0.38)
  Top 0.305: IC2.12 146.05,24.77 146.05,33.66 145.41,34.29 141.6,34.29 140.97,34.92 140.97,39.69 140.34,40.32 103.82,40.32 103.19,40.96 103.19,43.18 102.55,43.81 60.33,43.81 v59.69,43.18
  Bottom 0.305: v59.69,43.18 58.74,43.18 58.1,43.81 58.1,60.96 57.47,61.59 53.34,61.59 52.7,62.23 50.16,62.23 49.53,61.59 U$1.PF3
N$1
  Top 0.305: U$3.2 118.43,46.35 119.06,46.99 119.06,50.8 119.7,51.44 122.56,51.44 123.19,52.07 R11.1
  Top 0.406: Q3.6 123.61,53.34 R11.1 122.97,53.98
N$2
  Top 0.305: U$3.6 111.12,45.4 111.76,44.77 119.06,44.77 119.7,45.4 119.7,49.85 120.23,50.38 R10.2
  Top 0.406: Q3.7 123.61,50.8 R10.2
N$3
  Top 0.406: Q3.8 123.61,48.26 R10.1
  Bottom 0.305: U$3.3 114.94,51.44 115.57,52.07 123.83,52.07 124.46,51.44 124.46,48.9 125.09,48.26 Q3.8
N$4
  Top 0.406: LED2.A 149.57,69.83 R13.2
N$5
  Top 0.305: R11.2 122.77,55.46 121.92,54.61 121.92,52.7 121.28,52.07 118.11,52.07 117.47,51.44 U$3.1
  Top 0.406: Q3.5 123.61,55.88 R11.2
N$6
  Top 0.406: R14.2 144.49,71.96 LED3.A
N$7
  Top 0.406: LED4.A 149.54,73.94 R15.1
N$8
  Top 0.61: D4.C D3.A 125.09,13.39 R4.2
N$9
  Top 0.61: D6.C D5.A 10.79,13.6 R7.2
N$10
  Top 0.61: R4.1 C5.2
N$11
  Top 0.406: SJ2.1 151.76,48.98 C16.2
N$12
  Top 0.305: Q1.5 161.61,19.05 160.34,20.32 159.07,20.32 155.89,23.5 U$2.1
  Bottom 0.305: Q1.5 162.56,16.93 R18.2
N$13
  Top 0.61: C9.1 IC1.22
N$14
  Top 0.305: Q1.6 159.38,19.05 158.12,20.32 153.99,20.32 152.4,21.91 U$2.2
  Bottom 0.305: Q1.6 160.02,16.93 R18.1
N$15
  Top 0.61: R7.1 C9.2
N$16
  Top 0.61: C5.1 IC2.22
N$17
  Top 0.61: D2.C D1.A 68.58,13.6 R2.2
N$18
  Top 0.61: R2.1 C2.2
N$19
  Top 0.61: IC3.22 C2.1
N$20
  Top 0.305: U$2.6 151.45,29.84 150.81,29.21 150.81,21.27 151.45,20.64 152.72,20.64 153.67,19.68 153.67,17.46 154.31,16.83 156.84,16.83 157.48,17.46 Q1.7
  Bottom 0.305: R17.2 157.8,19.37 Q1.7
N$21
  Bottom 0.305: Q1.8 156.84,20.95 156.84,25.4 | 156.84,25.4 156.21,26.04 U$2.3 | R17.1 157.69,26.25 156.84,25.4
N$38
  Top 0.406: LED1.A 149.42,65.61 R12.1
N$139
  Top 0.406: R16.1 144.51,67.79 LED5.A
OCD_A_1
  Top 0.61: IC1.23 24.77,12.06 25.4,12.7 25.4,13.97 26.04,14.61 IC1.4 32.92,14.61 C8.2 35.51,14.5 R6.1
OCD_A_2
  Top 0.61: IC2.23 139.06,12.06 139.7,12.7 139.7,13.97 140.34,14.61 IC2.4 146.26,14.61 C4.2 149.18,14.5 R3.1
OCD_A_3
  Top 0.61: R1.1 92.66,14.5 C1.2 90.07,14.61 IC3.4 83.19,14.61 82.55,13.97 82.55,12.7 81.92,12.06 IC3.23
OCD_B_1
  Top 0.61: IC1.9 26.04,20.95 25.4,21.59 25.4,22.86 24.77,23.5 IC1.14 19.68,23.5 19.05,24.13 19.05,26.93 R8.1 C11.1
OCD_B_2
  Top 0.61: IC2.9 140.34,20.95 139.7,21.59 139.7,22.86 139.06,23.5 IC2.14 133.99,23.5 133.35,24.13 133.35,26.93 R5.1 C7.1
RSSI
  Top 0.406: U2.6 153.83,60.48 154.94,61.59 154.94,73.03 154.31,73.66 151.73,73.66 R15.2 151.6,74.3
RXD1
  Top 0.305: U$1.PC6 49.53,50.16 50.16,49.53 56.52,49.53 57.15,48.9 57.15,48.26 57.78,47.62 106.36,47.62 107,46.99 107,44.77 107.63,44.13 133.99,44.13 134.62,44.77 134.62,50.16 133.99,50.8 Q3.2
RXD2
  Top 0.305: U$1.PC4 49.53,55.24 50.16,54.61 57.78,54.61 58.42,53.98 58.42,49.53 59.05,48.9 107,48.9 107.63,49.53 107.63,51.44 108.27,52.07 111.12,52.07 111.76,52.7 111.76,60.33 110.49,61.59 U1.1
RXD3  (via drill 0.6)
  Top 0.305: U$1.PD6 49.53,45.09 50.16,44.45 55.24,44.45 55.88,45.09 55.88,45.68 56.52,46.32 105.09,46.35 105.73,45.72 105.73,43.5 106.36,42.86 146.05,42.86 | U2.2 145.83,37.69 v146.05,37.47
  Top 0.406: LED2.C 141,69.83 v140.97,69.85 | v146.05,60.64 146.05,42.86 146.05,40.88 U2.2
  Bottom 0.305: v146.05,37.47 146.05,35.88 147,34.92 153.99,34.92 155.26,33.66 157.8,33.66 159.38,32.07 159.38,25.72 160.34,24.77 162.88,24.77 163.83,23.81 163.83,15.56 163.19,14.92 158.75,14.92 157.48,13.65 Q1.2
  Bottom 0.406: v140.97,69.85 140.34,69.22 140.34,60.96 140.97,60.33 145.73,60.33 v146.05,60.64
RXD5
  Bottom 0.305: JP7.2 3.17,60.33 3.81,59.69 3.81,53.98 4.45,53.34 U$1.PE4
TXD1
  Top 0.305: U$1.PC7 49.53,47.62 50.16,46.99 105.73,46.99 106.36,46.35 106.36,44.13 107,43.5 134.62,43.5 135.25,44.13 135.25,52.7 134.62,53.34 Q3.3
TXD2
  Top 0.305: U$1.PC5 49.53,52.7 50.16,52.07 57.15,52.07 57.78,51.44 57.78,48.9 58.42,48.26 107.63,48.26 108.27,48.9 108.27,50.8 108.9,51.44 111.76,51.44 112.39,52.07 112.39,59.69 113.03,60.33 117.47,60.33 118.11,60.96 U1.4
TXD3  (via drill 0.6)
  Top 0.305: U$1.PD7 49.53,42.55 50.16,41.91 56.52,41.91 57.15,42.55 57.15,45.09 57.78,45.72 104.46,45.72 105.09,45.09 105.09,42.86 105.73,42.23 142.24,42.23 142.88,41.59 142.88,36.83 143.51,36.2 147.32,36.2 147.96,36.83 147.96,37.54 U2.3 148.98,36.51 v149.86,36.51
  Top 0.406: LED3.C 141.12,71.91 v140.97,71.75 | v147.96,56.52 147.96,37.79 U2.3
  Bottom 0.305: Q1.3 160.02,13.34 160.66,13.97 163.83,13.97 164.47,14.61 164.47,35.56 163.83,36.2 150.18,36.2 v149.86,36.51
  Bottom 0.406: v140.97,71.75 140.34,71.75 139.7,71.12 139.7,60.33 140.34,59.69 147.32,59.69 147.96,59.05 v147.96,56.52
TXD5
  Bottom 0.305: JP7.1 2.54,57.78 3.17,57.15 3.17,51.44 3.81,50.8 U$1.PE5
VBOOT_1
  Top 0.61: IC1.15 18.2,22.23 C10.2 17.78,24.77 17.14,25.4 11.43,25.4 10.79,24.77 D5.C
VBOOT_2
  Top 0.61: D3.C 125.09,24.77 125.73,25.4 131.44,25.4 132.08,24.77 C6.2 132.29,22.86 132.72,22.86 133.35,22.23 IC2.15
VBOOT_3
  Top 0.61: D1.C 68.58,24.77 69.22,25.4 74.3,25.4 74.93,24.77 C3.2 75.14,22.23 IC3.15
VIN  (via drill 1.3)
  Top 0.61: D4.A 128.27,21.59 | D6.A 13.97,21.59 | IC4.1 60.54,28.57 C13.1 | C17.1 IC5.1
  Top 1.016: C18.1 IC6.1
  Bottom 1.27: IC5.1 129.54,71.12 128.27,69.85 v128.27,33.02
  pour Top: 18.41,22.23 18.41,17.14 0,16.83 0,36.83 8.89,36.83 8.89,22.23
  pour Top (no thermals): 15.24,17.14 15.24,15.24 22.23,15.24 22.23,16.51 19.68,16.51 19.68,19.05 22.23,19.05 22.23,20.32 18.41,20.32 18.41,17.14
  pour Top (no thermals): 129.54,17.14 129.54,15.24 136.53,15.24 136.53,16.51 133.99,16.51 133.99,19.05 136.53,19.05 136.53,20.32 132.72,20.32 132.72,17.14
  pour Top: 132.72,22.23 132.72,17.14 118.11,17.14 118.11,36.83 123.19,36.83 123.19,22.23
  pour Top: 0,36.83 0,28.57 130.81,28.57 130.81,36.83
  pour Top (no thermals): 82.55,36.83 82.55,32.38 87.63,32.38 87.63,36.83
  pour Top: 46.99,29.21 46.99,22.86 49.53,22.86 49.53,29.21
XRESET
  Top 0.305: U$1.PF4 49.53,40.01 50.16,39.37 57.15,39.37 57.78,40.01 57.78,44.45 58.42,45.09 103.82,45.09 104.46,44.45 104.46,42.23 105.09,41.59 141.6,41.59 142.24,40.96 142.24,36.2 142.88,35.56 151.13,35.56 151.76,36.2 151.76,37.6 U2.5
  Top 0.406: U2.5 151.76,37.73 151.76,46.97 C16.1

### Text on the board
tPlace: RSSI | DIN | DOUT | DIO5 | PWR
tNames: 3V3 LDO | 5V LDO | 18V LDO | GND / RX5 / TX5 | Missouri S&T / Mars Rover Design Team / Robotic Arm Bord / September 2014 / #ROVESOHARD | 12V LDO | 12V LDO | A1_1 | A2_1 | B1_1 | B2_1 | A2_3 | A1_3 | A1_2 | A2_2 | B1_2 | B2_2 | Encoder 1 | Encoder 2 | GND | 5V | A0 | A7 | GND | 5V | A10 | A11